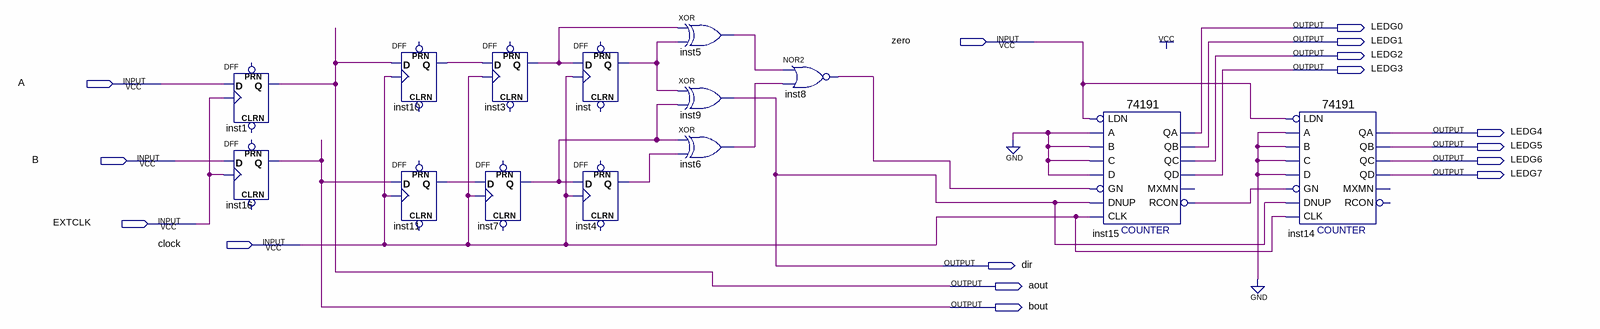
[diagram p0: schematic sheet]
// Quartus schematic all_edge_decoder.bdf as structural Verilog: 14 symbols, 16 pins
module all_edge_decoder (
  input  zero,
  input  A,
  input  B,
  input  EXTCLK,
  input  clock,
  output LEDG0,
  output LEDG1,
  output LEDG2,
  output LEDG3,
  output LEDG4,
  output LEDG5,
  output LEDG6,
  output LEDG7,
  output dir,
  output aout,
  output bout
);

  wire inst3_q, inst4_q, inst5_out, inst6_out, inst7_q, inst8_out, inst10_q, inst11_q, inst15_rcon, inst_q;

  DFF inst1 (.CLK(EXTCLK), .D(A), .Q(aout));  // open: CLRN, PRN
  DFF inst16 (.CLK(EXTCLK), .D(B), .Q(bout));  // open: CLRN, PRN
  DFF inst10 (.CLK(clock), .D(aout), .Q(inst10_q));  // open: CLRN, PRN
  DFF inst11 (.CLK(clock), .D(bout), .Q(inst11_q));  // open: CLRN, PRN
  DFF inst3 (.CLK(clock), .D(inst10_q), .Q(inst3_q));  // open: CLRN, PRN
  DFF inst7 (.CLK(clock), .D(inst11_q), .Q(inst7_q));  // open: CLRN, PRN
  DFF inst (.CLK(clock), .D(inst3_q), .Q(inst_q));  // open: CLRN, PRN
  DFF inst4 (.CLK(clock), .D(inst7_q), .Q(inst4_q));  // open: CLRN, PRN
  xor inst5 (inst5_out, inst3_q, inst_q);
  xor inst9 (dir, inst_q, inst7_q);
  xor inst6 (inst6_out, inst7_q, inst4_q);
  nor inst8 (inst8_out, inst5_out, inst6_out);
  \74191  inst15 (
    .LDN(zero), .D(1'b0), .C(1'b0), .B(1'b0), .A(1'b0), .CLK(clock), .DNUP(dir), .GN(inst8_out),
    .RCON(inst15_rcon), .QA(LEDG0), .QB(LEDG1), .QD(LEDG3), .QC(LEDG2));  // open: MXMN
  \74191  inst14 (
    .LDN(zero), .D(1'b0), .C(1'b0), .B(1'b0), .A(1'b0), .CLK(clock), .DNUP(dir), .GN(inst15_rcon),
    .QA(LEDG4), .QB(LEDG5), .QD(LEDG7), .QC(LEDG6));  // open: RCON, MXMN
endmodule
